# EAGLE design display_adapter (EAGLE 9.6.2)
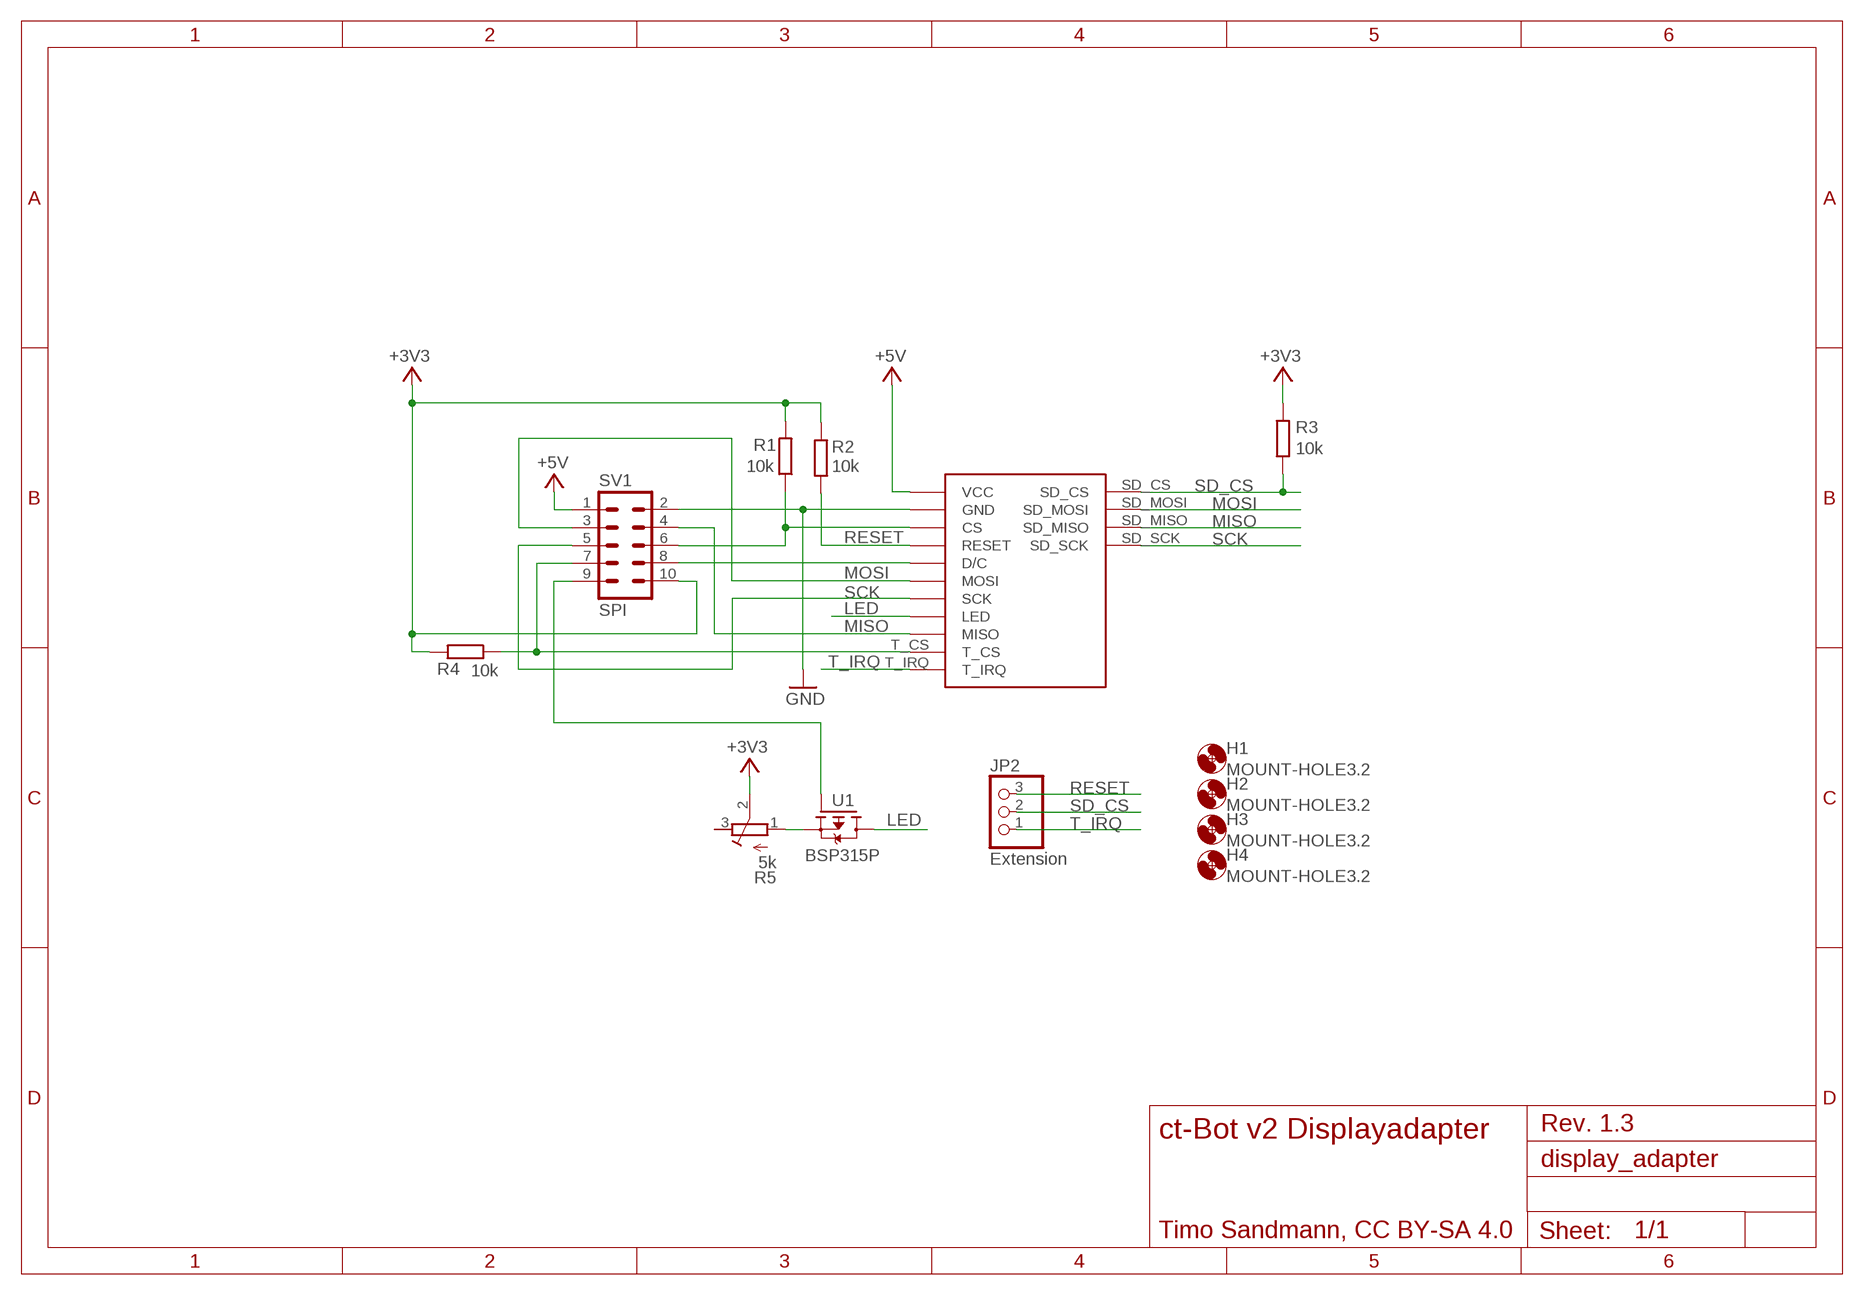
[diagram p0: schematic, sheet 1]

## Parts
H1  MOUNT-HOLE3.2  [3,2]
H2  MOUNT-HOLE3.2  [3,2]
H3  MOUNT-HOLE3.2  [3,2]
H4  MOUNT-HOLE3.2  [3,2]
J1  SPI_TFT_DISPLAY_TOUCH  [SPI_DISPLAY_TOUCH]
JP2  Extension  PINHD-1X3  [1X03]
R1  10k  R-EU_0204/7  [0204/7]
R2  10k  R-EU_0204/7  [0204/7]
R3  10k  R-EU_0204/7  [0204/7]
R4  10k  R-EU_0204/7  [0204/7]
R5  5k  R-TRIMM64W  [RTRIM64W]
SV1  SPI  ML10  [ML10]
U1  BSP315P  [PG-SOT-223]

## Nets
+3V3: R1.2 R2.2 R3.2 R4.2 R5.2(S) SV1.10
+5V: J1.VCC SV1.1
GND: J1.GND SV1.2
LED: J1.LED U1.2(D) U1.4(D)
MISO: J1.MISO J1.SD_MISO J1.T_MISO(MISO) SV1.4
MOSI: J1.MOSI J1.SD_MOSI J1.T_MOSI(MOSI) SV1.3
N$1: SV1.9 U1.1(G)
N$2: R5.1(A) U1.3(S)
N$3: J1.CS R1.1 SV1.6
N$5: J1.D/C SV1.8
N$6: J1.T_CS R4.1 SV1.7
RESET: J1.RESET JP2.3 R2.1
SCK: J1.SCK J1.SD_SCK J1.T_SCK(SCK) SV1.5
SD_CS: J1.SD_CS JP2.2 R3.1
T_IRQ: J1.T_IRQ JP2.1
Unconnected: R5.3(E)

## Notes on the sheet
- Rev. 1.3
- ct-Bot v2 Displayadapter
- Timo Sandmann, CC BY-SA 4.0

## Library data of the parts
H1-H4 = holes:MOUNT-HOLE: MOUNTING HOLE with drill center marker
J1 = tft:SPI_TFT_DISPLAY_TOUCH: SPI TFT Display with touch Connector for the cheap 2.4"/2.8" Serial SPI TFT displays with touch found on eBay.
JP2 = ct-bot:PINHD-1X3: PIN HEADER
R1-R4 = rcl:R-EU_: RESISTOR, European symbol; SPICEPREFIX: R
R5 = rcl:R-TRIMM: Trimm resistor; SPICEMODEL: X; SPICEPREFIXL: POT
SV1 = con-harting-ml:ML10: HARTING; OC_FARNELL: unknown; OC_NEWARK: unknown; SPICEPREFIX: X
U1 = ct-bot:BSP315P: SIPMOS (R) Small-Signal-Transistor P-Channel (2 Drain); OC_FARNELL: unknown; OC_NEWARK: unknown

## Board
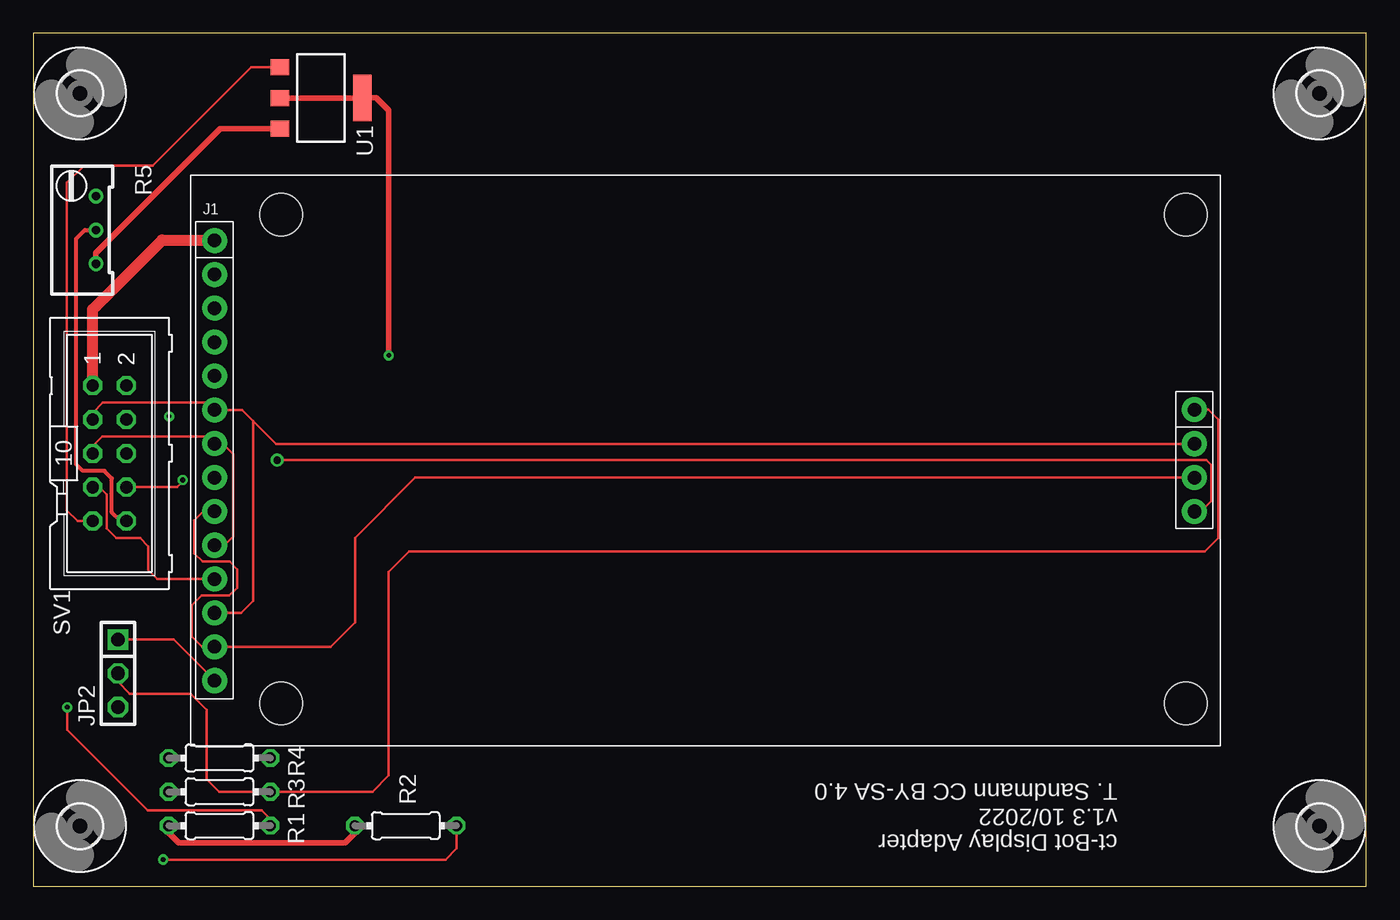
[diagram p1: board, top side]
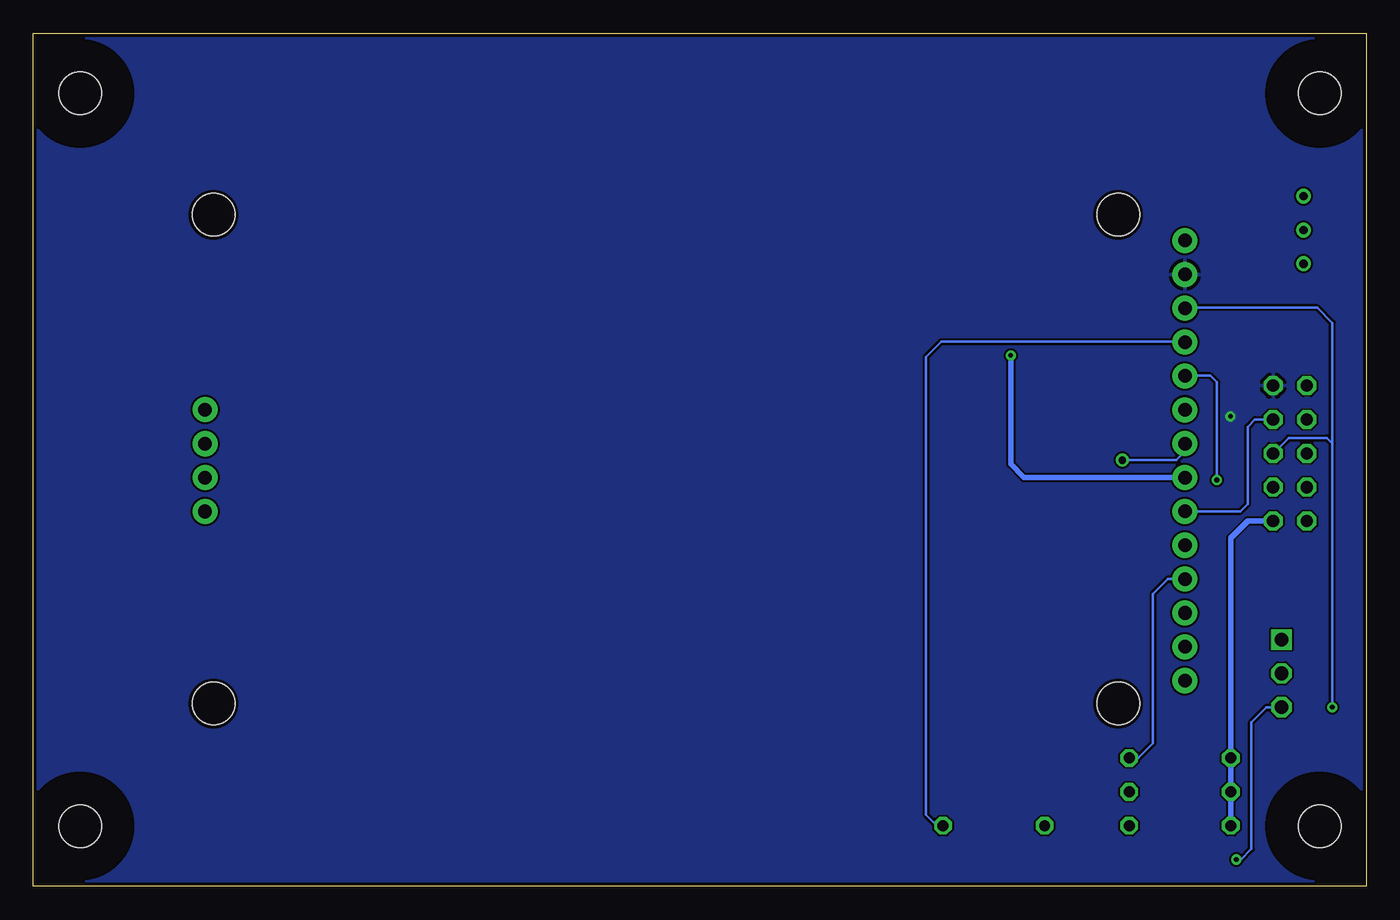
[diagram p2: board, bottom side, seen from below]

Size 100 x 64 mm. Coordinates in mm from the lower left corner, seen from the top.
Outline: 0,0 100,0 100,64 0,64 0,0
Copper layers (1*16): Top 0.035mm / dielectric 1.5mm / Bottom 0.035mm
Design rules "jlcpcb_2layer_DRU": minimum track width 6mil, minimum drill 0.3mm, track to track 6mil, track to pad 6mil, pad to pad 6mil, via to via 6mil, smd to smd 6mil, copper to edge 10mil, drill to drill 6mil, minimum pad ring 10mil, minimum via ring 8mil, stop-mask expansion 4mil, vias tented up to drill 0mil, thermal gap 10mil

### Footprints (pad centres in the part's own frame; a part is rotated, then mirrored left to right if it is on the bottom)
3,2 = hole 3.2: 0,0
SPI_DISPLAY_TOUCH = drill 1.016 pad 1.88: CS 1.778,32.766; D/C 1.778,27.686; GND 1.778,35.306; LED 1.778,20.066; MISO 1.778,17.526; MOSI 1.778,25.146; RESET 1.778,30.226; SCK 1.778,22.606; SD_CS 75.298,25.156; SD_MISO 75.298,20.06; SD_MOSI 75.298,22.6; SD_SCK 75.298,17.52; T_CS 1.778,12.446; T_IRQ 1.778,4.826; T_MISO 1.778,7.366; T_MOSI 1.778,9.906; T_SCK 1.778,14.986; VCC 1.778,37.846 | hole 3.2: 6.778,39.79; 6.778,3.11; 74.658,39.79; 74.658,3.11
1X03 = drill 1.016 square: 1 -2.54,0 | drill 1.016 octagon: 2 0,0; 3 2.54,0
0204/7 = drill 0.813 octagon: 1 -3.81,0; 2 3.81,0
RTRIM64W = drill 0.61: 1 1.27,-2.54; 2 1.27,0; 3 1.27,2.54
ML10 = drill 0.914 octagon: 1 -5.08,-1.27; 2 -5.08,1.27; 3 -2.54,-1.27; 4 -2.54,1.27; 5 0,-1.27; 6 0,1.27; 7 2.54,-1.27; 8 2.54,1.27; 9 5.08,-1.27; 10 5.08,1.27
PG-SOT-223 = smd 1.2 x 1.4: 1 -2.311,-3.099; 2 0,-3.099; 3 2.311,-3.099 | smd 3.5 x 1.4: 4 0,3.099

### Placement (x,y rotation side)
H1  3.5,59.5 0 top
H2  3.5,4.5 0 top
H3  96.5,4.5 0 top
H4  96.5,59.5 0 top
J1  11.82,10.6 0 top
JP2  6.35,15.97 270 top
R1  13.97,4.54 180 top
R2  27.94,4.54 180 top
R3  13.97,7.08 180 top
R4  13.97,9.62 180 top
R5  3.43,49.24 0 top
SV1  5.71,32.48 270 top
U1  21.59,59.15 270 top

### Tracks (layer width: path | path; a pad name or v marks a point on that pad's centre or on a via)
+3V3
  Top 0.305: SV1.10 6.56,27.4 5.9,28.06 5.9,30.6 5.33,31.17 3.96,31.17 3.95,31.16 3.71,31.16 3.21,31.66 3.21,48.59 3.86,49.24 R5.2
  Top 0.406: R2.2 24.13,3.99 23.4,3.26 10.92,3.26 10.16,4.02 R1.2
  Bottom 0.406: R1.2 R3.2 R4.2 10.16,26.13 8.89,27.4 SV1.10
+5V
  Top 0.813: SV1.1 4.45,43.27 9.65,48.48 13.56,48.48 J1.VCC
GND  (via drill 0.35)
  other vias: 10.18,35.26
  pour Bottom: 100.33,64.99 100.33,-0.92 -0.25,-0.92 -0.25,64.99
LED  (via drill 0.35)
  Top 0.406: v26.67,39.83 26.67,58.23 25.72,59.18 24.72,59.18 U1.4 U1.2
  Bottom 0.406: J1.LED 25.66,30.67 26.67,31.67 v26.67,39.82 v26.67,39.83
MISO
  Top 0.203: J1.MISO 12.74,28.13 12.07,27.46 12.07,24.98 12.7,24.35 14.71,24.35 15.28,23.79 15.28,22.39 14.71,21.81 12.63,21.81 11.89,21.06 11.89,18.73 12.65,17.97 J1.T_MISO 22.32,17.97 24.13,19.78 24.13,26.13 28.66,30.66 J1.SD_MISO
  Bottom 0.203: J1.MISO 9.43,28.13 8.89,28.67 8.89,34.47 8.34,35.02 SV1.4
MOSI
  Top 0.203: J1.T_MOSI 15.61,20.51 16.51,21.41 16.51,34.89 | 16.51,34.89 15.66,35.75 J1.MOSI 13.05,36.29 5.22,36.29 4.45,35.52 SV1.3 | J1.SD_MOSI 18.2,33.2 16.51,34.89
N$1
  Top 0.203: SV1.9 3.32,27.4 2.52,28.2 2.52,52.78 3.81,54.07 8.94,54.07 16.33,61.46 U1.1
N$2
  Top 0.406: R5.1 4.7,47.52 14.02,56.84 U1.3
N$3  (via drill 0.35)
  Top 0.203: R1.1 17.78,5.06 17.15,5.69 8.59,5.69 2.54,11.74 v2.54,13.43
  Bottom 0.203: J1.CS 13.56,43.4 3.68,43.4 2.54,42.26 2.54,33.22 | v2.54,13.43 2.54,33.22 | SV1.6 5.82,33.64 2.97,33.64 2.54,33.22
N$5  (via drill 0.35)
  Top 0.203: v11.2,30.48 11.2,30.34 10.8,29.94 SV1.8
  Bottom 0.203: v11.2,30.48 11.2,37.81 11.7,38.31 13.57,38.31 J1.D/C
N$6
  Top 0.203: J1.T_CS 9.31,23.05 8.64,23.72 8.64,25.5 8,26.13 6.22,26.13 5.49,26.86 5.49,29.38 4.93,29.94 SV1.7
  Bottom 0.203: J1.T_CS 14.89,23.05 16,21.93 16,10.72 17.1,9.62 R4.1
RESET  (via drill 0.35)
  Top 0.203: v9.74,2 30.93,2 31.76,2.83 31.76,4.53 R2.1
  Bottom 0.203: R2.1 32.2,4.54 33.02,5.36 33.02,39.72 31.88,40.86 13.63,40.86 J1.RESET | v9.74,2 9.42,2 8.62,2.8 8.62,12.3 7.49,13.43 JP2.3
SCK  (via drill 0.55)
  Top 0.203: J1.T_SCK 14.33,25.59 14.99,26.25 14.99,32.44 14.22,33.21 J1.SCK 13.05,33.75 5.17,33.75 4.45,33.03 SV1.5 | J1.SD_SCK 87.59,28.12 88.39,28.92 88.39,31.59 88.01,31.97 v18.29,31.97
  Bottom 0.203: v18.29,31.97 14.25,31.97 13.6,32.62 J1.SCK
SD_CS
  Top 0.203: J1.SD_CS 88.16,35.76 88.9,35.02 88.9,26.13 87.88,25.11 28.19,25.11 26.67,23.59 26.67,8.31 25.44,7.08 R3.1 13.93,7.08 13,8.01 13,13.23 11.79,14.45 7.22,14.45 6.35,15.32 JP2.2
T_IRQ
  Top 0.203: JP2.1 10.51,18.51 J1.T_IRQ

### Text on the board
tNames: ct-Bot Display Adapter / v1.3 10/2022 / T. Sandmann CC BY-SA 4.0